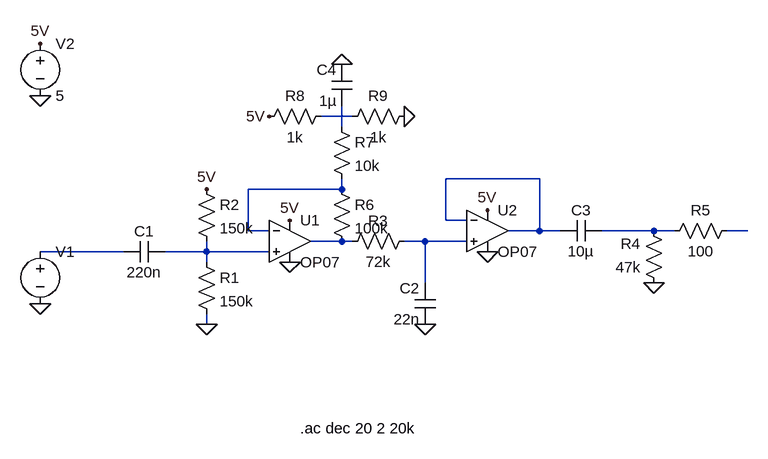
[diagram p0: schematic simulation_LTSpice.asc]
simulation_LTSpice.asc, the LTspice schematic file:
Version 4
SHEET 1 1252 680
WIRE 640 -80 592 -80
WIRE 624 -64 624 -96
WIRE 928 16 784 16
WIRE 624 32 624 16
WIRE 624 32 480 32
WIRE 784 80 784 16
WIRE 816 80 784 80
WIRE 480 96 480 32
WIRE 512 96 480 96
WIRE 928 96 928 16
WIRE 928 96 880 96
WIRE 960 96 928 96
WIRE 1104 96 1024 96
WIRE 1136 96 1104 96
WIRE 1248 96 1216 96
WIRE 624 112 576 112
WIRE 640 112 624 112
WIRE 752 112 720 112
WIRE 816 112 752 112
WIRE 288 128 160 128
WIRE 416 128 416 112
WIRE 416 128 352 128
WIRE 512 128 416 128
WIRE 416 144 416 128
WIRE 752 176 752 112
WIRE 416 240 416 224
FLAG 160 208 0
FLAG 160 -112 0
FLAG 160 -192 5V
FLAG 416 32 5V
FLAG 416 240 0
FLAG 544 80 5V
FLAG 544 144 0
FLAG 848 64 5V
FLAG 1104 176 0
FLAG 752 240 0
FLAG 848 128 0
FLAG 720 -80 0
FLAG 512 -80 5V
FLAG 624 -160 0
SYMBOL voltage 160 112 R0
SYMATTR InstName V1
SYMATTR Value ""
SYMATTR Value2 AC 1
SYMBOL res 400 128 R0
SYMATTR InstName R1
SYMATTR Value 150k
SYMBOL res 400 16 R0
SYMATTR InstName R2
SYMATTR Value 150k
SYMBOL voltage 160 -208 R0
SYMATTR InstName V2
SYMATTR Value 5
SYMBOL cap 352 112 R90
WINDOW 0 0 32 VBottom 2
WINDOW 3 32 32 VTop 2
SYMATTR InstName C1
SYMATTR Value 220n
SYMBOL OpAmps/OP07 544 48 R0
SYMATTR InstName U1
SYMBOL OpAmps/OP07 848 32 R0
SYMATTR InstName U2
SYMBOL res 736 96 R90
WINDOW 0 0 56 VBottom 2
WINDOW 3 32 56 VTop 2
SYMATTR InstName R3
SYMATTR Value 72k
SYMBOL cap 768 240 R180
WINDOW 0 24 56 Left 2
WINDOW 3 24 8 Left 2
SYMATTR InstName C2
SYMATTR Value 22n
SYMBOL cap 960 112 R270
WINDOW 0 32 32 VTop 2
WINDOW 3 0 32 VBottom 2
SYMATTR InstName C3
SYMATTR Value 10µ
SYMBOL res 1120 192 R180
WINDOW 0 36 76 Left 2
WINDOW 3 36 40 Left 2
SYMATTR InstName R4
SYMATTR Value 47k
SYMBOL res 1120 112 R270
WINDOW 0 32 56 VTop 2
WINDOW 3 0 56 VBottom 2
SYMATTR InstName R5
SYMATTR Value 100
SYMBOL res 608 16 R0
SYMATTR InstName R6
SYMATTR Value 100k
SYMBOL res 608 -80 R0
SYMATTR InstName R7
SYMATTR Value 10k
SYMBOL cap 640 -96 R180
WINDOW 0 24 56 Left 2
WINDOW 3 24 8 Left 2
SYMATTR InstName C4
SYMATTR Value 1µ
SYMBOL res 608 -96 R90
WINDOW 0 0 56 VBottom 2
WINDOW 3 32 56 VTop 2
SYMATTR InstName R8
SYMATTR Value 1k
SYMBOL res 736 -96 R90
WINDOW 0 0 56 VBottom 2
WINDOW 3 32 56 VTop 2
SYMATTR InstName R9
SYMATTR Value 1k
TEXT 560 400 Left 2 !.ac dec 20 2 20k

The netlist it stands for:
* simulation_LTSpice.asc
V1 N009 0 AC 1
R1 N010 0 150k
R2 5V N010 150k
V2 5V 0 5
C1 N010 N009 220n
XU1 N010 N004 5V 0 N007 LT1001  ; OP07, pins In+ In- V+ V- OUT
XU2 N008 N003 5V 0 N003 LT1001  ; OP07, pins In+ In- V+ V- OUT
R3 N008 N007 72k
C2 0 N008 22n
C3 N003 N005 10µ
R4 0 N005 47k
R5 N005 N006 100
R6 N004 N007 100k
R7 N002 N004 10k
C4 N002 0 1µ
R8 N001 5V 1k
R9 0 N001 1k
.ac dec 20 2 20k
.lib LTC.lib
.backanno
.end